# EAGLE design mm.controller.v1 (EAGLE 6.2)
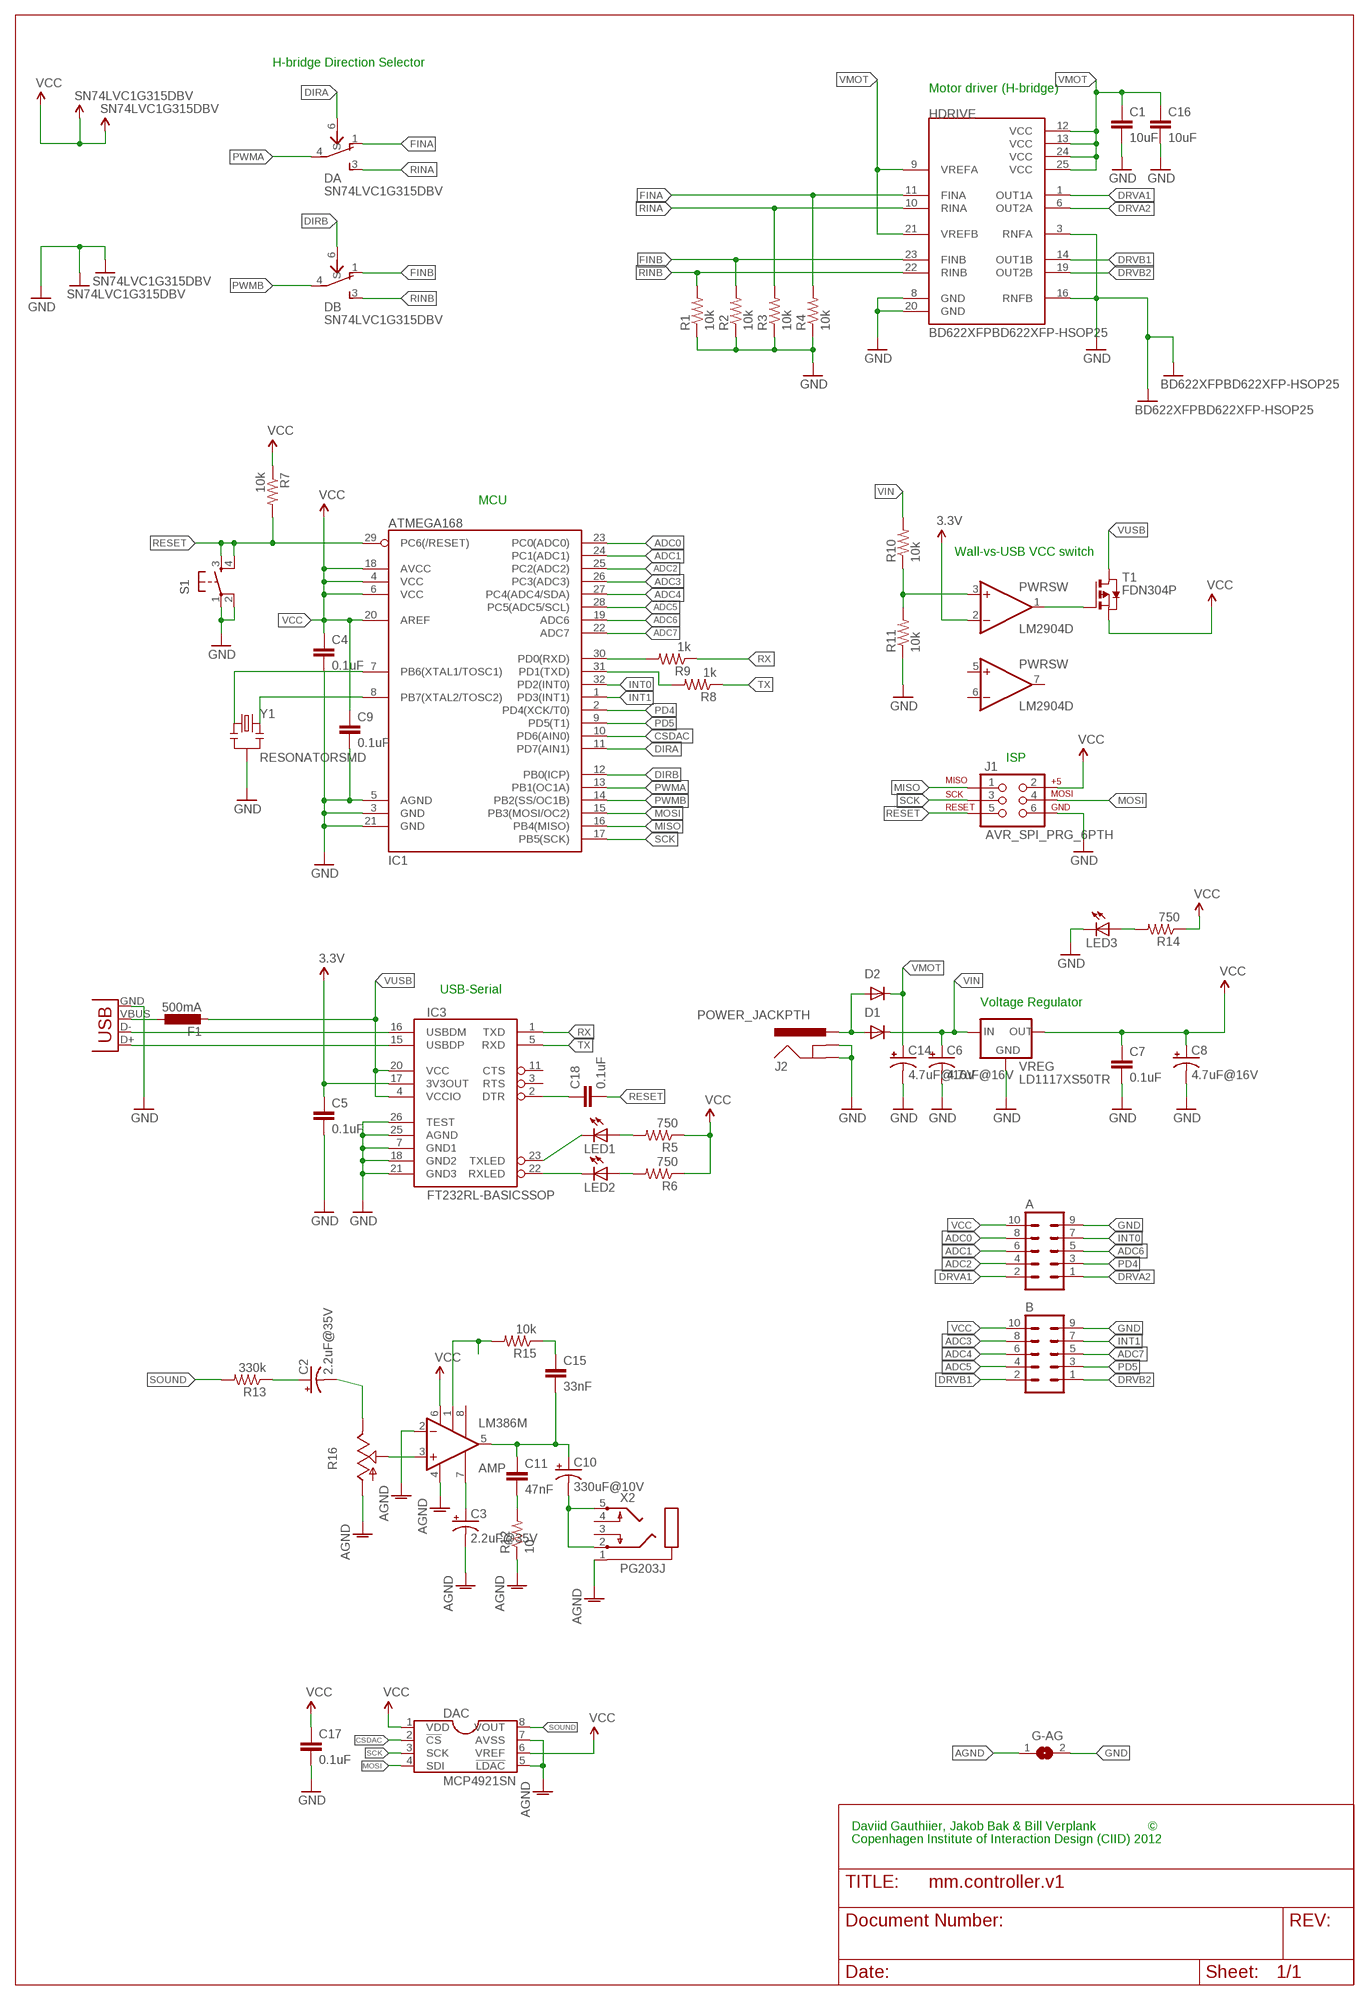
[diagram p0: schematic, sheet 1]

## Parts
A  ML10  [ML10]
AMP  LM386M  [SOIC8]
B  ML10  [ML10]
C1  10uF  CAP0805  [0805]
C2  2.2uF@35V  CPOL-USB  [PANASONIC_B]
C3  2.2uF@35V  CPOL-USB  [PANASONIC_B]
C4  0.1uF  CAP0805  [0805]
C5  0.1uF  CAP0805  [0805]
C6  4.7uF@16V  CPOL-USB  [PANASONIC_B]
C7  0.1uF  CAP0805  [0805]
C8  4.7uF@16V  CPOL-USB  [PANASONIC_B]
C9  0.1uF  CAP0805  [0805]
C10  330uF@10V  CPOL-USF  [PANASONIC_F]
C11  47nF  CAP0805  [0805]
C14  4.7uF@16V  CPOL-USB  [PANASONIC_B]
C15  33nF  CAP0805  [0805]
C16  10uF  CAP0805  [0805]
C17  0.1uF  CAP0805  [0805]
C18  0.1uF  CAP0805  [0805]
D1  DIODESMB  [SMB-DIODE]
D2  DIODESMB  [SMB-DIODE]
DA  SN74LVC1G315DBV  [SOT23-6]
DAC  MCP4921SN  [SOIC8]
DB  SN74LVC1G315DBV  [SOT23-6]
F1  500mA  L-EUL1812  [L1812]
G-AG  SJ  [SJ]
HDRIVE  BD622XFPBD622XFP-HSOP25  [HSOP25]
IC1  ATMEGA168  [TQFP32-08]
IC3  FT232RL-BASICSSOP  [SSOP28DB]
J1  AVR_SPI_PRG_6PTH  [2X3]
J2  POWER_JACKPTH  [POWER_JACK_PTH]
LED1  LED1206  [LED-1206]
LED2  LED1206  [LED-1206]
LED3  LED1206  [LED-1206]
PWRSW  LM2904D  [SOIC8]
R1  10k  RESISTOR0805-RES  [0805]
R2  10k  RESISTOR0805-RES  [0805]
R3  10k  RESISTOR0805-RES  [0805]
R4  10k  RESISTOR0805-RES  [0805]
R5  750  RESISTOR0805-RES  [0805]
R6  750  RESISTOR0805-RES  [0805]
R7  10k  RESISTOR0805-RES  [0805]
R8  1k  RESISTOR0805-RES  [0805]
R9  1k  RESISTOR0805-RES  [0805]
R10  10k  RESISTOR0805-RES  [0805]
R11  10k  RESISTOR0805-RES  [0805]
R12  10  RESISTOR0805-RES  [0805]
R13  330k  RESISTOR0805-RES  [0805]
R14  750  RESISTOR0805-RES  [0805]
R15  10k  RESISTOR0805-RES  [0805]
R16  TRIM_US-PT10  [PT-10]
S1  TAC_SWITCHSMD  [TACTILE_SWITCH_SMD]
T1  FDN304P  PMOSSOT23  [SOT-23]
VREG  LD1117XS50TR  [SOT223]
X1  USB-SMD-NS  [USB-MINIB-NOSTOP]
X2  PG203J  [PG203J]
Y1  RESONATORSMD  [RESONATOR-SMD]

## Nets
3.3V: C5.1 IC3.17(3V3OUT) PWRSW.2(-INA)
ADC0: A.8 IC1.23(PC0(ADC0))
ADC1: A.6 IC1.24(PC1(ADC1))
ADC2: A.4 IC1.25(PC2(ADC2))
ADC3: B.8 IC1.26(PC3(ADC3))
ADC4: B.6 IC1.27(PC4(ADC4/SDA))
ADC5: B.4 IC1.28(PC5(ADC5/SCL))
ADC6: A.5 IC1.19(ADC6)
ADC7: B.5 IC1.22(ADC7)
AGND: AMP.2(-IN) AMP.4(V-) C3.- DAC.5(!LDAC) DAC.7(AVSS) G-AG.1 R12.1 R16.A X2.1
CSDAC: DAC.2(!CS) IC1.10(PD6(AIN0))
DIRA: DA.6(S) IC1.11(PD7(AIN1))
DIRB: DB.6(S) IC1.12(PB0(ICP))
DRVA1: A.2 HDRIVE.1(OUT1A)
DRVA2: A.1 HDRIVE.6(OUT2A)
DRVB1: B.2 HDRIVE.14(OUT1B)
DRVB2: B.1 HDRIVE.19(OUT2B)
FINA: DA.1(INA) HDRIVE.11(FINA) R4.2
FINB: DB.1(INA) HDRIVE.23(FINB) R2.2
GND: A.9 B.9 C1.2 C4.2 C5.2 C6.- C7.2 C8.- C9.2 C14.- C16.2 C17.2 DA.2(GND) DB.2(GND) G-AG.2 HDRIVE.3(RNFA) HDRIVE.8(GND) HDRIVE.16(RNFB) HDRIVE.20(GND) HDRIVE.GND@1(GND) HDRIVE.GND@2(GND) IC1.3(GND) IC1.5(AGND) IC1.21(GND) IC3.7(GND1) IC3.18(GND2) IC3.21(GND3) IC3.25(AGND) IC3.26(TEST) J1.6 J2.GND J2.GNDBREAK LED3.C R1.1 R2.1 R3.1 R4.1 R11.1 S1.1 S1.2 VREG.1(GND) X1.GND Y1.2
INT0: A.7 IC1.32(PD2(INT0))
INT1: B.7 IC1.1(PD3(INT1))
MISO: IC1.16(PB4(MISO)) J1.1
MOSI: DAC.4(SDI) IC1.15(PB3(MOSI/OC2)) J1.4
N$1: IC1.7(PB6(XTAL1/TOSC1)) Y1.1
N$2: IC1.8(PB7(XTAL2/TOSC2)) Y1.3
N$3: IC3.16(USBDM) X1.D-
N$4: IC3.15(USBDP) X1.D+
N$5: IC3.23(TXLED) LED1.C
N$6: IC3.22(RXLED) LED2.C
N$7: LED1.A R5.2
N$8: LED2.A R6.2
N$9: F1.1 X1.VBUS
N$10: IC1.30(PD0(RXD)) R9.2
N$11: IC1.31(PD1(TXD)) R8.2
N$12: AMP.3(+IN) R16.S
N$13: PWRSW.3(+INA) R10.1 R11.2
N$14: PWRSW.1(OUTA) T1.3(G)
N$15: LED3.A R14.2
N$16: C18.1 IC3.2(DTR)
N$18: C2.+ R13.1
N$19: AMP.5(OUT) C10.+ C11.1 C15.2
N$20: C10.- X2.2 X2.5
N$21: C11.2 R12.2
N$23: C15.1 R15.1
N$24: AMP.1(G1) R15.2
N$71: AMP.7(BYPASS) C3.+
PD4: A.3 IC1.2(PD4(XCK/T0))
PD5: B.3 IC1.9(PD5(T1))
PWMA: DA.4(OUT) IC1.13(PB1(OC1A))
PWMB: DB.4(OUT) IC1.14(PB2(SS/OC1B))
RESET: C18.2 IC1.29(PC6(/RESET)) J1.5 R7.2 S1.3 S1.4
RINA: DA.3(INB) HDRIVE.10(RINA) R3.2
RINB: DB.3(INB) HDRIVE.22(RINB) R1.2
RX: IC3.1(TXD) R9.1
SCK: DAC.3(SCK) IC1.17(PB5(SCK)) J1.3
SIN: C2.- R16.E
SOUND: DAC.8(VOUT) R13.2
TX: IC3.5(RXD) R8.1
VCC: A.10 AMP.6(V+) B.10 C4.1 C7.1 C8.+ C9.1 C17.1 DA.5(VCC) DAC.1(VDD) DAC.6(VREF) DB.5(VCC) IC1.4(VCC) IC1.6(VCC) IC1.18(AVCC) IC1.20(AREF) J1.2 R5.1 R6.1 R7.1 R14.1 T1.2(S) VREG.2(OUT)
VIN: C6.+ D1.C R10.2 VREG.3(IN)
VMOT: C1.1 C14.+ C16.1 D2.C HDRIVE.9(VREFA) HDRIVE.12(VCC) HDRIVE.13(VCC) HDRIVE.21(VREFB) HDRIVE.24(VCC) HDRIVE.25(VCC)
VUSB: F1.2 IC3.4(VCCIO) IC3.20(VCC) T1.1(D)
VWALL: D1.A D2.A J2.PWR
Unconnected: AMP.8(G2) IC3.3(RTS) IC3.11(CTS) PWRSW.5(+INB) PWRSW.6(-INB) PWRSW.7(OUTB) VREG.4(GND) X2.3 X2.4

## Notes on the sheet
- H-bridge Direction Selector
- Motor driver (H-bridge)
- MCU
- Wall-vs-USB VCC switch
- ISP
- USB-Serial
- Voltage Regulator
- Daviid Gauthiier, Jakob Bak & Bill Verplank | ©
- Copenhagen Institute of Interaction Design (CIID) 2012

## Power pins joined to a net without a drawn wire
GND: PWRSW.4(GND)
VCC: PWRSW.8(VCC)

## Library data of the parts
A B = con-harting-ml:ML10: HARTING
AMP = dviiid:LM386: The LM386 is a power amplifier designed for use in low voltage consumer applications.
C1 C4 C5 C7 C9 C11 C15-C18 = SparkFun:CAP: Capacitor Standard 0603 ceramic capacitor, and 0.1" leaded capacitor.
C2 C3 C6 C8 C10 C14 = rcl:CPOL-US: POLARIZED CAPACITOR, American symbol
D1 D2 = SparkFun:DIODE: Diode These are standard reverse protection diodes and small signal diodes. SMA package can handle up to about 1A. SOD-323 can handle about 200mA. What the SOD-323 package when ordering, there are some mfgs out there that are 5-pin packages.
DA DB = dviiid:SN74LVC1G315: This single-pole, double-throw (SPDT) analog switch is designed for 1.65-V to 5.5-V V CC operation. The SN74LVC1G3157 can handle both analog and digital signals. The device permits signals with amplitudes of up to V CC (peak) to be transmitted in either direction. Applications include signal gating, chopping, modulation or demodulation (modem), and signal multiplexing for analog-to-digital and digital-to-analog conversion systems.
DAC = dviiid:MCP4921
F1 = rcl:L-EU: INDUCTOR, European symbol
G-AG = jumper:SJ: SMD solder JUMPER
HDRIVE = dviiid:BD622XFP: Full H-bridge driver - 2 channel - PWM control
IC1 = SparkFun:ATMEGA168
IC3 = SparkFun:FT232RL-BASIC: USB UART This is the simplified version of the FT232RL unit. Only what you need, nothing you don't. Spark Fun Electronics SKU : COM-00650
J1 = SparkFun:AVR_SPI_PRG_6: AVR ISP 6 Pin This is the reduced ISP connector for AVR programming. Common on Arduino. This footprint will take up less PCB space and can be used with a 10-pin to 6-pin adapter such as SKU: BOB-08508
J2 = SparkFun:POWER_JACK: Power Jack This is the standard 5.5mm barrel jack for power. The PTH is the most common, proven, reliable, footprint. All others are experimental. The Slot footprint only works if the mill layer is transmitted to the PCB fab house so be warned. Spark Fun Electronics SKU : PRT-00119. Mating wall wart : TOL-00298 (and others)
LED1-LED3 = SparkFun:LED: LEDs Standard schematic elements and footprints for 5mm, 3mm, 1206, and 0603 sized LEDs. 5mm - Spark Fun Electronics SKU : COM-00529 (and others)
PWRSW = dviiid:LM2904: Low power dual operational amplifier.
R1-R15 = SparkFun:RESISTOR: Resistor Basic schematic elements and footprints for 0603, 1206, and PTH resistors.
R16 = pot:TRIM_US-: POTENTIOMETER
S1 = SparkFun:TAC_SWITCH: Momentary Switch Button commonly used for reset or general input. Spark Fun Electronics SKU : COM-00097
T1 = zetex:PMOSSOT23: MOS FET
VREG = dviiid:LD1117X: Adjustable and fixed low drop positive voltage regulator
X1 = SparkFun:USB: USB Connectors USB-B-PTH is fully proven SKU : PRT-00139 USB-miniB is fully proven SKU : PRT-00587 USB-A-PCB is untested. USB-A-H is throughly reviewed, but untested. Spark Fun Electronics SKU : PRT-00437 USB-B-SMT is throughly reviewed, but untested. Needs silkscreen touching up. USB-A-S has not been used/tested USB-MB-H has not been used/tested
X2 = con-hirschmann:PG203J: MIC/HEADPHONE JACK KS-S stereo microphone/headphone jack PG203JN (Schukat)
Y1 = SparkFun:RESONATOR: Resonator Small SMD resonator. This is the itty bitty 10/20MHz resonators with built in caps. CSTCE10M0G55 and CSTCE20M0V53. Footprint has been reviewed closely but hasn't been tested yet.

## Board
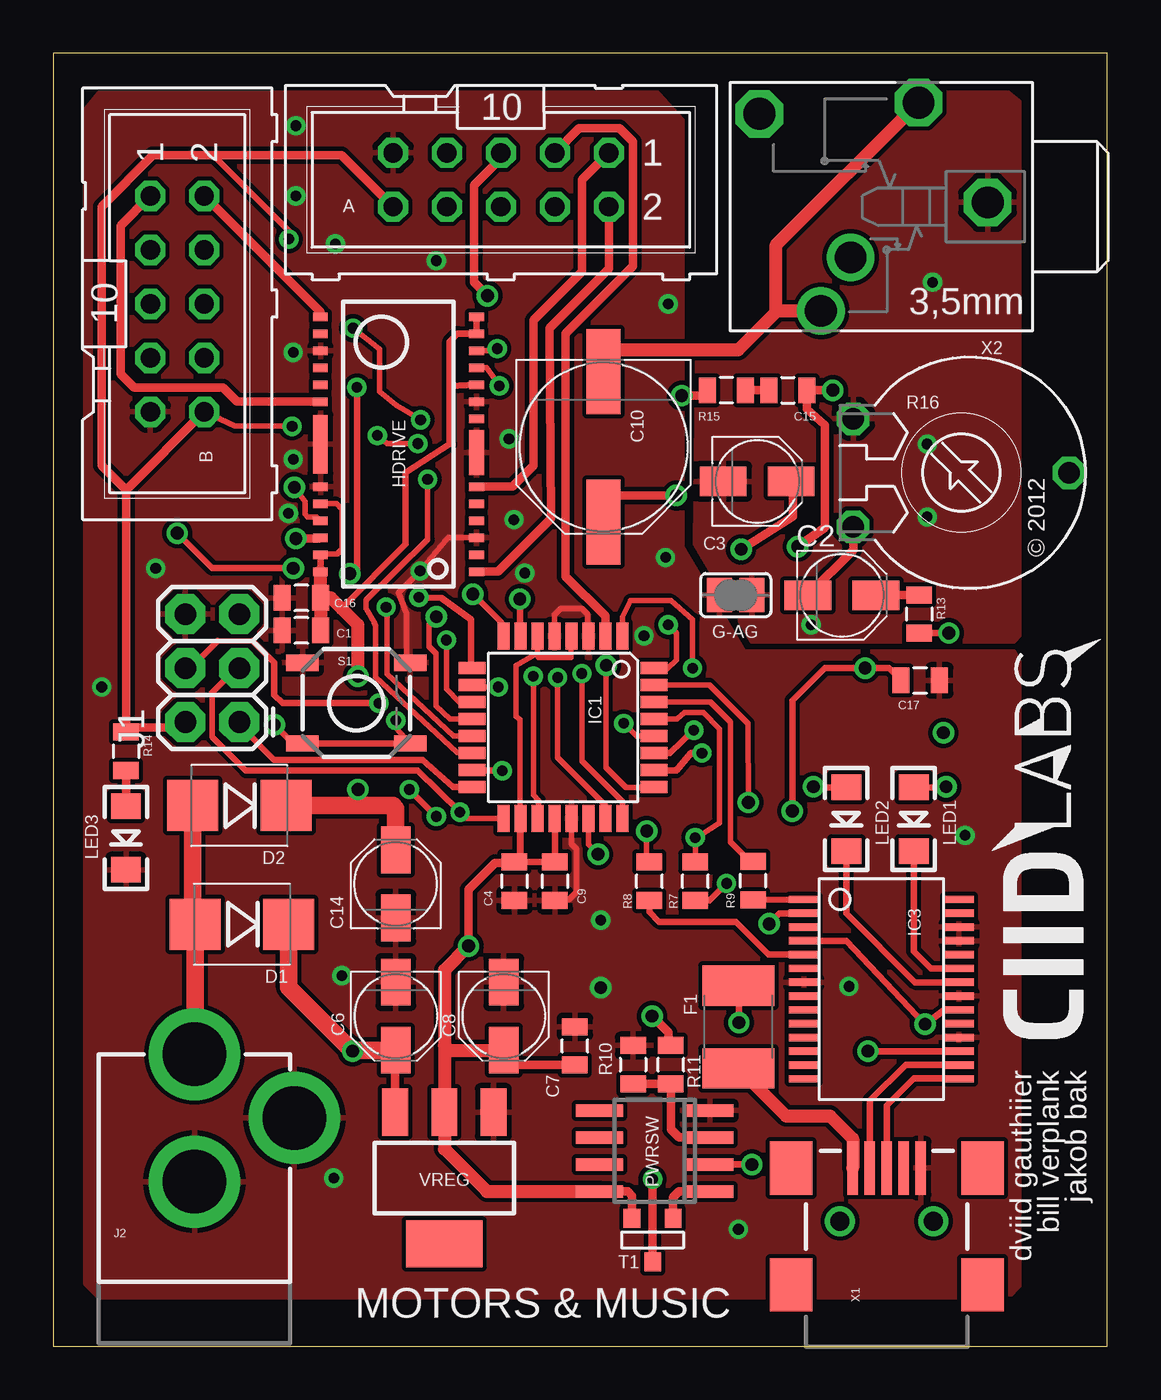
[diagram p1: board, top side]
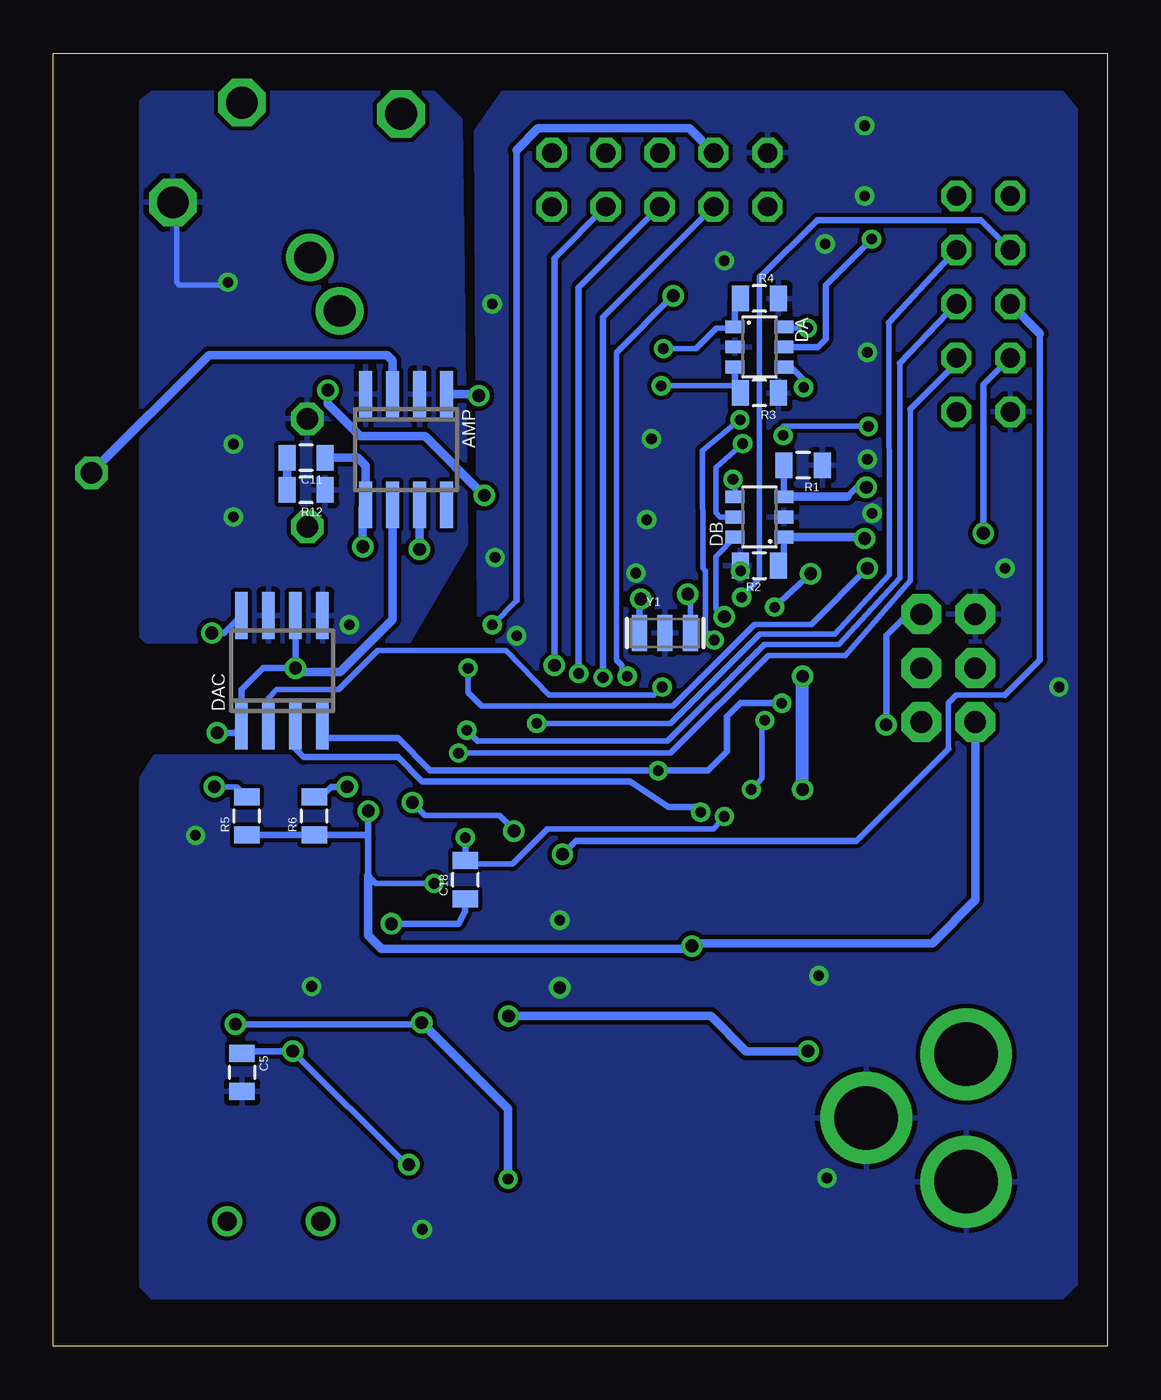
[diagram p2: board, bottom side, seen from below]

Size 49.63 x 60.87 mm. Coordinates in mm from the lower left corner, seen from the top.
Outline: 0,0 49.63,0 49.63,60.87 0,60.87 0,0
Copper layers (1*16): Top 0.035mm / dielectric 1.5mm / Bottom 0.035mm
Design rules: minimum track width 10mil, minimum drill 19mil, track to track 8mil, track to pad 8mil, pad to pad 8mil, via to via 8mil, smd to smd 8mil, copper to edge 40mil, drill to drill 8mil, minimum pad ring 10mil, minimum via ring 8mil, stop-mask expansion 4mil, vias tented up to drill 0mil, thermal gap 10mil

### Footprints (pad centres in the part's own frame; a part is rotated, then mirrored left to right if it is on the bottom)
ML10 = drill 0.914 octagon: 1 -5.08,-1.27; 2 -5.08,1.27; 3 -2.54,-1.27; 4 -2.54,1.27; 5 0,-1.27; 6 0,1.27; 7 2.54,-1.27; 8 2.54,1.27; 9 5.08,-1.27; 10 5.08,1.27
SOIC8 = smd 0.6 x 2.2: 1 -1.905,-2.6; 2 -0.635,-2.6; 3 0.635,-2.6; 4 1.905,-2.6; 5 1.905,2.6; 6 0.635,2.6; 7 -0.635,2.6; 8 -1.905,2.6
0805 = smd 0.8 x 1.2: 1 -0.9,0; 2 0.9,0
PANASONIC_B = smd 2.2 x 1.4: + 1.6,0; - -1.6,0
PANASONIC_F = smd 4 x 1.6: + 3.55,0; - -3.55,0
SMB-DIODE = smd 2.4 x 2.4: A 2.2,0; C -2.2,0
SOT23-6 = smd 0.6 x 0.9: 1 -0.95,-1.15; 2 0,-1.15; 3 0.95,-1.15; 4 0.95,1.15; 5 0,1.15; 6 -0.95,1.15
L1812 = smd 1.9 x 3.4: 1 -1.95,0; 2 1.95,0
SJ = smd 1.168 x 1.6: 1 -0.762,0; 2 0.762,0
HSOP25 = smd 0.4 x 0.7: 1 -6,-3.675; 2 -5.2,-3.675; 3 -4.4,-3.675; 4 -3.6,-3.675; 5 -2.8,-3.675; 6 -2,-3.675; 7 1.2,-3.675; 8 2,-3.675; 9 2.8,-3.675; 10 3.6,-3.675; 11 4.4,-3.675; 12 5.2,-3.675; 13 6,-3.675; 14 6,3.675; 15 5.2,3.675; 16 4.4,3.675; 17 3.6,3.675; 18 2.8,3.675; 19 2,3.675; 20 -2,3.675; 21 -2.8,3.675; 22 -3.6,3.675; 23 -4.4,3.675; 24 -5.2,3.675; 25 -6,3.675 | smd 2.1 x 0.7: GND@1 -0.4,-3.675 | smd 2.75 x 0.7: GND@2 0,3.675
TQFP32-08 = smd 1.27 x 0.559: 1 -4.293,2.8; 2 -4.293,2; 3 -4.293,1.2; 4 -4.293,0.4; 5 -4.293,-0.4; 6 -4.293,-1.2; 7 -4.293,-2; 8 -4.293,-2.8; 17 4.293,-2.8; 18 4.293,-2; 19 4.293,-1.2; 20 4.293,-0.4; 21 4.293,0.4; 22 4.293,1.2; 23 4.293,2; 24 4.293,2.8 | smd 0.559 x 1.27: 9 -2.8,-4.293; 10 -2,-4.293; 11 -1.2,-4.293; 12 -0.4,-4.293; 13 0.4,-4.293; 14 1.2,-4.293; 15 2,-4.293; 16 2.8,-4.293; 25 2.8,4.293; 26 2,4.293; 27 1.2,4.293; 28 0.4,4.293; 29 -0.4,4.293; 30 -1.2,4.293; 31 -2,4.293; 32 -2.8,4.293
SSOP28DB = smd 0.348 x 1.397: 1 -4.225,-3.656; 2 -3.575,-3.656; 3 -2.925,-3.656; 4 -2.275,-3.656; 5 -1.625,-3.656; 6 -0.975,-3.656; 7 -0.325,-3.656; 8 0.325,-3.656; 9 0.975,-3.656; 10 1.625,-3.656; 11 2.275,-3.656; 12 2.925,-3.656; 13 3.575,-3.656; 14 4.225,-3.656; 15 4.225,3.656; 16 3.575,3.656; 17 2.925,3.656; 18 2.275,3.656; 19 1.625,3.656; 20 0.975,3.656; 21 0.325,3.656; 22 -0.325,3.656; 23 -0.975,3.656; 24 -1.625,3.656; 25 -2.275,3.656; 26 -2.925,3.656; 27 -3.575,3.656; 28 -4.225,3.656
2X3 = drill 1.016 pad 1.88 octagon: 1 0,0; 2 0,2.54; 3 2.54,0; 4 2.54,2.54; 5 5.08,0; 6 5.08,2.54
POWER_JACK_PTH = drill 2.997 pad 4.318: GND 0,7.7; GNDBREAK 4.7,10.7; PWR 0,13.7
LED-1206 = smd 1.2 x 1.4: A -1.5,0; C 1.5,0
PT-10 = drill 1.016 octagon: A -2.54,-5.08; E 2.54,-5.08; S 0,5.08
TACTILE_SWITCH_SMD = smd 1.524 x 0.762: 1 -2.54,1.905; 2 2.54,1.905; 3 -2.54,-1.905; 4 2.54,-1.905
SOT-23 = smd 0.787 x 0.889: 1 0.025,-1.016; 2 -0.94,1.016; 3 0.991,1.016
SOT223 = smd 1.219 x 2.235: 1 -2.311,-3.099; 2 0,-3.099; 3 2.311,-3.099 | smd 3.6 x 2.2: 4 0,3.099
USB-MINIB-NOSTOP = smd 2.5 x 0.5: D+ 2.5,0; D- 2.5,0.8; GND 2.5,-1.6; ID 2.5,-0.8; VBUS 2.5,1.6 | smd 2.5 x 2: G1 -3,-4.5; G2 -3,4.5; G3 2.5,4.5; G4 2.5,-4.5 | drill 0.9 pad 0.8: H1 0,2.2 | drill 0.9 pad 0.787: H2 0,-2.2
PG203J = drill 1.499 octagon: 1 -5.004,-0.203; 4 5.74,-4.369; 5 -1.753,-4.902 | drill 1.499: 2 2.845,4.902; 3 1.448,2.388
RESONATOR-SMD = smd 0.7 x 1.7: 1 -1.2,0; 2 0,0; 3 1.2,0

### Placement (x,y rotation side)
A  21.08,54.91 180 top
AMP  33.02,42.21 180 bottom
B  5.84,49.07 270 top
C1  11.68,33.71 180 top
C2  37.13,35.36 0 top
C3  33.15,40.72 0 top
C4  21.72,21.89 270 top
C5  40.74,12.9 270 bottom
C6  16.13,15.54 270 top
C7  24.56,14.15 90 top
C8  21.21,15.54 270 top
C9  23.62,21.89 270 top
C10  25.91,42.34 270 top
C11  37.72,41.83 180 bottom
C14  16.13,21.77 90 top
C15  34.59,45.01 0 top
C16  11.68,35.23 180 top
C17  40.82,31.34 0 top
C18  30.23,21.97 90 bottom
D1  8.89,19.86 180 top
D2  8.76,25.45 180 top
DA  16.38,47.04 270 bottom
DAC  38.86,31.8 0 bottom
DB  16.38,39.04 90 bottom
F1  32.26,15.04 90 top
G-AG  32.13,35.36 180 top
HDRIVE  16.26,42.47 90 top
IC1  24,29.13 270 top
IC3  38.99,16.81 270 top
J1  8.76,29.39 90 top
J2  6.65,0.05 0 top
LED1  40.51,24.82 270 top
LED2  37.34,24.82 270 top
LED3  3.43,23.93 270 top
PWRSW  28.32,9.19 90 top
R1  14.33,41.48 180 bottom
R2  16.38,36.75 0 bottom
R3  16.38,44.88 180 bottom
R4  16.38,49.33 180 bottom
R5  40.51,24.97 90 bottom
R6  37.34,24.97 90 bottom
R7  30.23,21.89 90 top
R8  28.07,21.89 90 top
R9  32.94,21.92 90 top
R10  29.08,13.26 90 top
R11  27.31,13.26 270 top
R12  37.72,40.31 180 bottom
R13  40.77,34.47 270 top
R14  3.43,28.02 270 top
R15  31.7,45.01 180 top
R16  42.75,41.12 270 top
S1  14.27,30.28 0 top
T1  28.19,5 0 top
U$2  [CIID-LABS-LOGO]  49.35,14.48 90 top
VREG  18.42,7.92 180 top
X1  39.24,5.89 90 top
X2  38.99,53.64 180 top
Y1  20.83,33.58 0 bottom

### Tracks (layer width: path | path; a pad name or v marks a point on that pad's centre or on a via)
3.3V  (via drill 0.6)
  Top 0.305: IC3.17 v38.35,13.89 | PWRSW.2 v32.89,8.56
  Bottom 0.305: v32.89,8.56 33.02,8.56 v38.35,13.89 40.66,13.89 | 40.64,13.77 40.77,13.89 40.66,13.89 | C5.1 40.74,13.82 40.66,13.89
ADC0  (via drill 0.5)
  Top 0.254: v23.75,31.48 23.75,27.71 26.01,25.45 IC1.23
  Bottom 0.305: v23.75,31.48 23.75,48.44 A.8
ADC1  (via drill 0.5)
  Top 0.254: v24.89,31.67 24.89,27.56 26.8,25.65 IC1.24
  Bottom 0.305: v24.89,31.67 24.89,49.83 A.6
ADC2  (via drill 0.6)
  Top 0.254: v26.04,32.05 26.04,27.25 26.98,26.31 28.28,26.31 IC1.25
  Bottom 0.305: v26.04,32.05 26.04,51.23 A.4
ADC3  (via drill 0.5)
  Top 0.305: v30.54,27.93 30.04,27.93 29.34,27.1 28.33,27.1 IC1.26
  Bottom 0.254: 9.27,44.12 9.27,36.04 12.34,32.51 15.95,32.51 20.57,27.93 v30.54,27.93
  Bottom 0.305: B.8 7.11,46.28 9.27,44.12
ADC4  (via drill 0.5)
  Top 0.305: v30.16,29.01 29.03,27.93 IC1.27
  Bottom 0.254: 9.78,46.28 9.78,36.17 12.65,33.05 16.15,33.05 20.7,28.5 29.66,28.5
  Bottom 0.305: 9.78,46.28 B.6 | 29.66,28.5 v30.16,29.01
ADC5  (via drill 0.5)
  Top 0.254: IC1.28 27.45,28.73 v26.86,29.32
  Bottom 0.254: 10.29,48.18 10.26,36.32 12.83,33.53 16.36,33.53 20.57,29.32 v26.86,29.32
  Bottom 0.305: 10.29,48.18 B.4
ADC6  (via drill 0.5, 0.6)
  Top 0.254: 22.86,24.9 22.86,25.7 22.61,25.96 v22.61,31.55
  Top 0.406: A.5 21.08,55.93 19.81,54.66 19.81,50.09 v20.45,49.45 | IC1.19 22.86,24.9
  Bottom 0.254: 22.86,31.55 22.86,32.05 23.11,32.31 23.11,46.79 v20.45,49.45
  Bottom 0.305: v22.61,31.55 22.86,31.55
ADC7  (via drill 0.6)
  Top 0.254: v25.65,23.16 25.2,23.62 IC1.22
  Top 0.305: IC1.22 25.27,24.77
  Bottom 0.254: 4.83,30.66 7.11,30.66 7.49,30.28 7.49,28.12
  Bottom 0.305: 3.18,47.68 3.18,32.31 4.83,30.66 | 7.49,28.12 11.81,23.8 25.02,23.8 v25.65,23.16
  Bottom 0.406: 3.18,47.68 B.5
AGND  (via drill 0.5)
  Bottom 0.254: X2.1 43.81,53.67 43.81,50.09 43.69,49.96 41.4,49.96 v41.4,50.09
  other vias: 41.15,42.47 41.15,39.04 35.69,33.96
  pour Top: 30.99,36.5 32.89,33.2 45.21,33.2 45.47,33.45 45.47,58.6 44.96,58.98 31.75,58.98 30.48,57.71 30.23,37.77
  pour Bottom: 32.89,33.2 45.21,33.2 45.47,33.45 45.47,58.6 44.96,58.98 31.75,58.98 30.48,57.71 30.23,37.77
CSDAC  (via drill 0.5)
  Top 0.254: 19.81,31.04 v20.96,31.04
  Top 0.305: IC1.10 19.81,31.04
  Bottom 0.254: v20.96,31.04 21.34,30.66 26.29,30.66 28.32,32.75 34.35,32.75 36.2,30.91 39.12,30.91 39.5,30.53 DAC.2
DIRA  (via drill 0.5)
  Top 0.254: IC1.11 19.12,30.33 18.52,30.94 v18.52,33.25 | v17.3,43.61 16.15,44.3 15.37,44.93 15.37,46.94 v14.12,47.93
  Bottom 0.254: v18.52,33.25 18.67,33.32 18.92,33.71 18.92,36.5 19.05,36.63 19.08,42.16 v17.3,43.61 | v14.12,47.93 15.17,47.93 DA.6
DIRB  (via drill 0.6)
  Top 0.254: 19.16,29.53 19.15,29.54 18.69,29.54 18.03,30.15 18.03,32.61 17.7,32.94 17.7,34.01 v18.03,34.34
  Top 0.305: 19.16,29.53 IC1.12
  Bottom 0.254: DB.6 18.44,37.18 18.44,34.7 18.09,34.34 v18.03,34.34
DRVA1
  Top 0.406: A.2 26.16,50.72 23.37,47.93 23.44,38.96 20.95,36.47 HDRIVE.1
DRVA2
  Top 0.406: HDRIVE.6 21.62,40.47 22.61,41.45 22.61,48.31 24.89,50.6 24.89,54.91 A.1
DRVB1
  Top 0.406: HDRIVE.14 12.58,48.68 B.2
DRVB2
  Top 0.406: HDRIVE.19 8.67,44.47 8,45.14 3.81,45.14 3.18,45.77 3.18,52.76 B.1
FINA  (via drill 0.5)
  Top 0.254: HDRIVE.11 20.87,46.87 v20.9,46.96
  Bottom 0.254: v20.9,46.96 19.38,46.96 18.42,47.93 17.59,47.93 DA.1
  Bottom 0.305: R4.2 17.53,49.33 DA.1
FINB  (via drill 0.6)
  Top 0.406: v11.43,38.02 12.54,38.02 HDRIVE.23
  Bottom 0.305: R2.2 15.23,36.75 DB.1
  Bottom 0.406: DB.1 11.5,38.09 v11.43,38.02
GND  (via drill 0.5, 0.6)
  Top 0.254: IC1.21 24.4,23.65 24.64,23.42 24.64,21.39 24.26,21.01 23.63,21.01 C9.2 | IC1.5 23.6,34.45 23.88,34.72 24.89,34.72 25.15,34.47 25.15,33.48 IC1.3 | HDRIVE.3 18.59,38.07 v17.27,36.5 16.26,35.48 16.64,34.47 16.64,32.44 S1.2
  Bottom 0.254: v17.27,36.5 R2.1
  other vias: 25.78,16.89 4.83,36.63 13.28,51.89 11.3,41.76 21.69,38.91 18.03,51.1 21.46,42.72 27.81,33.45 28.96,49.07 11.43,54.15 32.26,5.51 13.59,17.45 13.21,7.92 37.46,16.94 25.78,20.07 42.93,24.05 2.29,31.04 11.43,57.45 11.3,46.79 28.83,37.13 22.2,36.4 11.07,39.22
  pour Bottom: 2.16,2.34 44.96,2.34 45.47,2.84 45.47,26.72 44.83,27.74 35.69,27.74 29.57,34.09 29.69,57.2 28.45,58.98 2.16,58.98 1.52,58.22 1.52,2.97
  pour Top: 1.52,58.22 1.52,2.97 2.16,2.34 44.96,2.34 45.47,2.84 45.47,32.18 45.21,32.69 32.51,32.69 29.59,37.62 29.59,57.71 28.45,58.98 2.16,58.98
INT0  (via drill 0.5)
  Top 0.254: 28.68,31.9 28.93,31.9 29.34,32.31 29.34,33.58 v28.96,33.96
  Top 0.406: IC1.32 28.68,31.9
  Bottom 0.254: v28.96,33.96 27.81,35.1
  Bottom 0.305: 27.81,35.1 27.81,56.31
  Bottom 0.406: 27.81,56.31 26.8,57.33 19.69,57.33 A.7
INT1  (via drill 0.5, 0.6)
  Top 0.254: IC1.1 26.8,34.34 27.18,35.1 29.08,35.1 30.1,34.21 v30.1,31.93
  Top 0.305: v5.84,38.28 7.49,36.63 v11.3,36.63 | IC1.1 26.92,33.31
  Bottom 0.254: v11.3,36.63 13.94,33.98 16.61,33.98 20.45,30.15 29.46,30.15 30.1,30.78 v30.1,31.93
  Bottom 0.305: B.7 5.84,45.26 v5.84,38.28
MISO
  Top 0.305: J1.1 8.76,29.26 10.41,27.61 17.4,27.61 18.82,26.34 IC1.16
MOSI  (via drill 0.5)
  Top 0.254: 7.75,33.2 9.4,33.2
  Top 0.305: v21.15,27.1 19.74,27.1 IC1.15 19.68,27.1 | J1.4 6.48,31.93 7.75,33.2 | 9.4,33.2 10.41,32.18 10.41,30.66 10.79,30.28 v15.33,30.28
  Bottom 0.305: DAC.4 36.96,28.63 33.4,28.63 31.88,27.1 v21.15,27.1 18.8,27.1 17.91,27.99 17.91,29.64 17.27,30.28 v15.33,30.28
N$1  (via drill 0.6)
  Top 0.305: IC1.7 21.97,33.46 v21.97,35.18
  Bottom 0.305: v21.97,35.18 22.03,34.92 Y1.1
N$2  (via drill 0.6)
  Top 0.254: 19.84,35.38 v19.76,35.41 21.11,34.06 21.11,33.43
  Top 0.305: 21.11,33.43 IC1.8
  Bottom 0.254: v19.76,35.41 19.63,35.17 Y1.3
  Bottom 0.305: Y1.3 19.69,33.64
N$3
  Top 0.305: X1.D- 38.44,11.57 40.13,13.26 42.63,13.26 IC3.16
N$4
  Top 0.305: X1.D+ 39.24,11.35 40.51,12.62 42.61,12.62 IC3.15
N$5
  Top 0.305: IC3.23 41.32,17.79 40.51,18.59 LED1.C
N$6
  Top 0.305: IC3.22 40.57,17.14 37.34,20.37 LED2.C
N$7  (via drill 0.6)
  Top 0.305: LED1.A 41.89,26.32 v42.04,26.34
  Bottom 0.254: v42.04,26.34 41.31,26.34 40.98,26.34 R5.2
N$8  (via drill 0.6)
  Top 0.305: LED2.A 35.96,26.32 v35.79,26.34
  Bottom 0.254: v35.79,26.34 36.55,26.34 37.02,25.87 R6.2
  Bottom 0.305: v35.79,26.34 36.54,26.34
N$9
  Top 0.61: X1.VBUS 37.64,9.78 36.58,10.85 34.5,10.85 F1.1
N$10
  Top 0.254: IC1.30 30.93,30.33 31.88,29.39 31.88,23.74 32.79,22.82 R9.2
N$11  (via drill 0.6)
  Top 0.254: IC1.31 30.89,31.13 32.7,29.32 v32.73,25.6 | v27.94,24.26 27.94,23 28.07,22.87 R8.2
  Top 0.305: IC1.31 28.33,31.17
  Bottom 0.254: v27.94,24.26 27.94,24.31 28.63,24.99 32.12,24.99 v32.73,25.6
N$12
  Bottom 0.406: AMP.3 33.66,46.41 33.91,46.66 42.29,46.66 R16.S
N$13
  Top 0.254: 26.98,12.36 R11.2
  Top 0.406: PWRSW.3 29.46,9.83 29.08,10.21 R10.1 R11.2
N$14
  Top 0.406: T1.3 29.18,7.01 29.46,7.29 PWRSW.1
N$15
  Top 0.406: LED3.A R14.2
N$16  (via drill 0.6)
  Top 0.305: IC3.2 34.18,20.39 v33.71,19.89
  Bottom 0.305: v33.71,19.89 30.56,19.89 30.25,20.47 30.25,21.05 C18.1
N$18
  Top 0.406: R13.1 38.73,35.37 C2.+
N$19  (via drill 0.6)
  Top 0.406: v35.05,37.64 36.32,38.53 36.32,43.36 35.49,44.11 C15.2 v36.7,45.01 | v29.34,40.06 26.29,40.06 26.04,40.31 26.04,38.92 C10.+
  Bottom 0.406: v35.05,37.64 35.05,39.49 AMP.5 34.92,41.45 35.31,41.83 C11.1 | v36.7,45.01 36.7,44.37 35.18,42.85 32.13,42.85 v29.34,40.06
N$20
  Top 0.61: X2.5 34.04,51.84 34.04,48.69 | 34.04,48.69 32.26,46.91 25.91,46.91 C10.- | 34.04,48.69 34.09,48.74 X2.2
N$21
  Bottom 0.406: R12.2 C11.2
N$23
  Top 0.406: R15.1 C15.1
N$24  (via drill 0.6)
  Top 0.406: v29.59,44.75 30.6,44.75 R15.2
  Bottom 0.406: AMP.1 29.65,44.81 v29.59,44.75
N$71  (via drill 0.6)
  Top 0.406: v32.38,37.52 34.83,39.07 34.83,40.72 C3.+
  Bottom 0.406: v32.38,37.52 AMP.7
PD4
  Top 0.406: IC1.2 26,34.37 24.13,36.25 24.13,47.68 27.31,50.85 27.31,56.69 26.67,57.33 24.77,57.33 A.3
PD5  (via drill 0.5)
  Top 0.305: IC1.9 19.69,31.96 19.69,34.21 18.29,35.23 v17.22,35.25
  Bottom 0.254: v17.22,35.25 16.38,36.14 16.38,50.37 16.33,50.34 13.67,53.01
  Bottom 0.305: B.3 5.97,53.01 13.67,53.01
PWMA  (via drill 0.5, 0.6)
  Top 0.254: IC1.13 18.85,28.73 15.72,31.65 15.72,34.66 v15.67,34.8
  Top 0.305: v14.3,45.14 14.3,36.5 v13.97,36.37
  Bottom 0.254: DA.4 14.9,46.09 14.3,45.49 v14.3,45.14
  Bottom 0.305: v14.3,45.14 14.48,45.34 | v15.67,34.8 v13.97,36.37
PWMB  (via drill 0.5)
  Top 0.254: IC1.14 19.01,27.95 15.19,31.51 15.19,33.9 15.11,34.09 14.73,34.72 14.73,35.13 17.63,37.97 v17.63,40.82
  Bottom 0.254: v17.63,40.82 17.45,39.95 DB.4
RESET  (via drill 0.5, 0.6)
  Top 0.254: IC1.29 29.36,29.53 29.72,29.83 30.61,29.83 31.37,29.07 31.37,24.64 30.23,23.9 | v16.76,26.21 v18.03,24.94 | v16.13,29.46 16.13,29.13 S1.4 | v30.23,23.95 30.23,23.9 | 30.23,23.9 R7.2
  Top 0.305: S1.4 S1.3 11.3,28.37 v10.41,29.26
  Bottom 0.254: 16.51,26.47 16.26,26.72 16.26,29.13 v16.13,29.46 | v18.03,24.94 18.01,24.94 18.54,24.36 26.39,24.36 26.39,24.33 28.02,22.71 30.14,22.71 R7.2 C18.2
  Bottom 0.305: J1.5 9.4,34.47 10.41,33.45 v10.41,29.26 | 16.51,26.47 v16.76,26.21 | C18.2 v30.23,23.95
RINA  (via drill 0.5)
  Top 0.254: HDRIVE.10 20.4,46.07 v21.01,45.21
  Bottom 0.254: v21.01,45.21 17.61,45.21 arc-90 17.53,45.29
  Bottom 0.305: R3.2 17.53,44.75 17.53,45.29 DA.3
RINB  (via drill 0.6)
  Top 0.254: v11.35,40.44 11.86,39.78 11.86,39.17 11.99,39.04 12.41,39.04 HDRIVE.22
  Bottom 0.254: 12.25,39.99 11.81,40.44 v11.35,40.44
  Bottom 0.305: DB.3 R1.2
  Bottom 0.406: 12.25,39.99 DB.3
RX
  Top 0.305: R9.1 IC3.1 | R9.1 | R9.1
SCK  (via drill 0.5)
  Top 0.254: 7.49,30.78 7.49,28.68 9.07,27.1 | IC1.17 19.48,24.84 v19.15,25.15
  Top 0.305: J1.3 8.64,31.93 7.49,30.78 | 9.07,27.1 17.15,27.1 v19.15,25.15
  Bottom 0.305: DAC.3 38.23,28.12 37.85,27.74 33.4,27.74 32.26,26.59 22.48,26.59 20.68,25.4 19.41,25.4 v19.15,25.15
SIN
  Top 0.406: C2.- 37.67,37.49 R16.E
SOUND  (via drill 0.6)
  Top 0.305: R13.2 42.15,33.57 v42.16,33.58
  Bottom 0.305: v42.16,33.58 41.59,33.58 DAC.8
TX
  Top 0.305: IC3.5 33.68,18.44 32.13,19.99 28.52,19.99 28.07,20.45 R8.1
VCC  (via drill 0.5, 0.6)
  Top 0.254: IC1.18 21.97,24.87 21.97,29.51 21.78,29.64 21.78,32.05 22.8,32.63 | 22.8,32.63 IC1.6 | 22.8,32.63 22.8,32.49 22.86,32.44 24.38,32.44 24.38,33.41 IC1.4 | B.10 8.56,43.31 v11.25,43.31 | v15.26,42.87 15.72,42.49 v17.17,42.49
  Top 0.305: C4.1 21.97,23.04 21.97,24.81 IC1.18 22,22.88 22.07,22.81 23.61,22.81 C9.1 23.62,24.82 IC1.20 | v34.8,25.2 34.8,30.4 36.32,31.93 v38.23,31.93 39.33,31.93 C17.1 | v11.1,52.12 11.1,52.5 7.54,56.06 | R7.1 30.9,20.99 v31.7,21.79
  Top 0.406: T1.2 27.25,7.09 27.05,7.29 PWRSW.8 | 21.58,22.66 C4.1 21.68,22.76 20.8,22.76 19.56,21.51 v19.56,18.85 | 6.22,29.22 J1.2 5.97,29.13 3.56,29.13 | 3.56,29.13 3.43,29.26 3.43,40.31 | 3.43,40.31 B.10 | A.10 13.59,56.06 7.54,56.06 4.7,56.06 2.29,53.64 2.29,41.45 3.43,40.31 | C7.1 21.91,13.25 C8.+ | R14.1 3.56,28.92 3.56,29.13
  Top 0.61: 18.42,14.15 VREG.2 18.42,9.3 20.42,7.29 PWRSW.8 | 18.42,14.15 18.42,17.7 v19.56,18.85 | C8.+ 18.62,13.94 18.42,14.15
  Bottom 0.254: v31.7,21.79 34.44,21.79 34.8,22.15 | DB.5 18.24,39.04 18.44,39.24 18.44,41.38 v17.17,42.49 | v11.25,43.31 15.26,43.31 v15.26,42.87 15.26,42.85
  Bottom 0.305: 34.8,22.15 34.8,23.93 | 34.8,23.93 v34.8,25.2 | DAC.6 v38.23,31.93 39.75,31.93 40.77,30.91 DAC.1 41.09,28.88 v41.91,28.88 | DA.5 13.64,47.04 13.26,47.42 13.26,49.96 v11.1,52.12 | R5.1 R6.1 34.94,24.07 34.8,23.93
  Bottom 0.406: 34.8,22.15 34.8,19.35 34.16,18.72 19.69,18.72 v19.56,18.85 19.43,18.97 8.25,18.97 6.22,21.01 J1.2 | AMP.6 33.66,34.21 36.13,31.74 38.04,31.74 v38.23,31.93
VIN  (via drill 0.6)
  Top 0.406: VREG.3 16.1,13.92 C6.+ | v28.19,15.54 28.96,14.78 28.96,14.29 R10.2
  Top 0.813: D1.C 11.09,16.9 v14.1,13.89 14.15,13.94 C6.+
  Bottom 0.406: v28.19,15.54 18.67,15.54 17.02,13.89 v14.1,13.89
VMOT  (via drill 0.6)
  Top 0.254: HDRIVE.21 13.34,39.67 13.61,39.4 13.61,37.54 13.36,37.29 12.6,37.29 HDRIVE.24
  Top 0.305: HDRIVE.25 HDRIVE.24 | 18.66,45.19 HDRIVE.9 | 18.66,45.19 18.67,45.77 18.67,47.29 19.05,47.68 HDRIVE.12 HDRIVE.13 | 18.66,45.19 18.66,42.46 16.59,41.12 16.59,37.77 13.59,34.72
  Top 0.61: C14.+ 16.21,23.29 | 14.35,25.45 v14.35,26.21 | v14.35,31.55 14.35,33.96 13.59,34.72 13.08,35.23 C16.1 | C16.1 C1.1 | C16.1 HDRIVE.25
  Top 0.813: D2.C 14.35,25.45 16,25.45 16.13,25.32 C14.+
  Bottom 0.61: v14.35,26.21 v14.35,31.55
VUSB  (via drill 0.5, 0.6)
  Top 0.305: IC3.20 41.95,15.84 v41.05,15.16 37.35,19.09 IC3.4 | v32.28,15.24 F1.2 | 31.75,16.69 31.33,17.11
  Top 0.406: 31.75,16.69 31.96,16.69 F1.2 | T1.1 v28.22,7.87
  Bottom 0.305: v41.05,15.16 32.64,15.16 v32.28,15.24
  Bottom 0.406: v28.22,7.87 28.22,11.18 v32.28,15.24
VWALL
  Top 0.813: J2.PWR 6.69,14.55 D1.A 6.56,19.99 D2.A

### Text on the board
tNames: © 2012 | dviid gauthiier | bill verplank | jakob bak | MOTORS & MUSIC